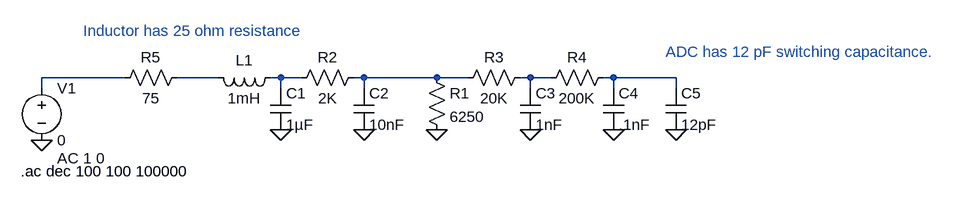
[diagram p0: schematic NewFilter.asc]
NewFilter.asc, the LTspice schematic file:
Version 4
SHEET 1 1500 680
WIRE 208 112 80 112
WIRE 352 112 288 112
WIRE 448 112 432 112
WIRE 480 112 448 112
WIRE 576 112 560 112
WIRE 688 112 576 112
WIRE 736 112 688 112
WIRE 832 112 816 112
WIRE 864 112 832 112
WIRE 960 112 944 112
WIRE 1056 112 960 112
WIRE 80 128 80 112
WIRE 448 128 448 112
WIRE 576 128 576 112
WIRE 832 128 832 112
WIRE 960 128 960 112
WIRE 1056 128 1056 112
FLAG 80 208 0
FLAG 448 192 0
FLAG 576 192 0
FLAG 832 192 0
FLAG 960 192 0
FLAG 688 192 0
FLAG 1056 192 0
SYMBOL res 576 96 R90
WINDOW 0 0 56 VBottom 2
WINDOW 3 32 56 VTop 2
SYMATTR InstName R2
SYMATTR Value 2K
SYMBOL cap 432 128 R0
SYMATTR InstName C1
SYMATTR Value 1µF
SYMBOL cap 560 128 R0
SYMATTR InstName C2
SYMATTR Value 10nF
SYMBOL voltage 80 112 R0
WINDOW 123 24 124 Left 2
WINDOW 39 0 0 Left 2
SYMATTR Value2 AC 1 0
SYMATTR InstName V1
SYMATTR Value 0
SYMBOL res 832 96 R90
WINDOW 0 0 56 VBottom 2
WINDOW 3 32 56 VTop 2
SYMATTR InstName R3
SYMATTR Value 20K
SYMBOL res 960 96 R90
WINDOW 0 0 56 VBottom 2
WINDOW 3 32 56 VTop 2
SYMATTR InstName R4
SYMATTR Value 200K
SYMBOL cap 816 128 R0
SYMATTR InstName C3
SYMATTR Value 1nF
SYMBOL cap 944 128 R0
SYMATTR InstName C4
SYMATTR Value .1nF
SYMBOL ind 448 96 R90
WINDOW 0 5 56 VBottom 2
WINDOW 3 32 56 VTop 2
SYMATTR InstName L1
SYMATTR Value 1mH
SYMBOL res 672 96 R0
SYMATTR InstName R1
SYMATTR Value 6250
SYMBOL res 304 96 R90
WINDOW 0 0 56 VBottom 2
WINDOW 3 32 56 VTop 2
SYMATTR InstName R5
SYMATTR Value 75
SYMBOL cap 1040 128 R0
SYMATTR InstName C5
SYMATTR Value 12pF
TEXT 48 256 Left 2 !.ac dec 100 100 100000
TEXT 144 40 Left 2 ;Inductor has 25 ohm resistance
TEXT 1040 72 Left 2 ;ADC has 12 pF switching capacitance.

The netlist it stands for:
* NewFilter.asc
R2 N004 N003 2K
C1 N003 0 1µF
C2 N004 0 10nF
V1 N001 0 0 AC 1 0
R3 N005 N004 20K
R4 N006 N005 200K
C3 N005 0 1nF
C4 N006 0 .1nF
L1 N003 N002 1mH
R1 N004 0 6250
R5 N002 N001 75
C5 N006 0 12pF
.ac dec 100 100 100000
* Inductor has 25 ohm resistance
* ADC has 12 pF switching capacitance.
.backanno
.end